# Altium schematic sheet ESP32.SchDoc
size B
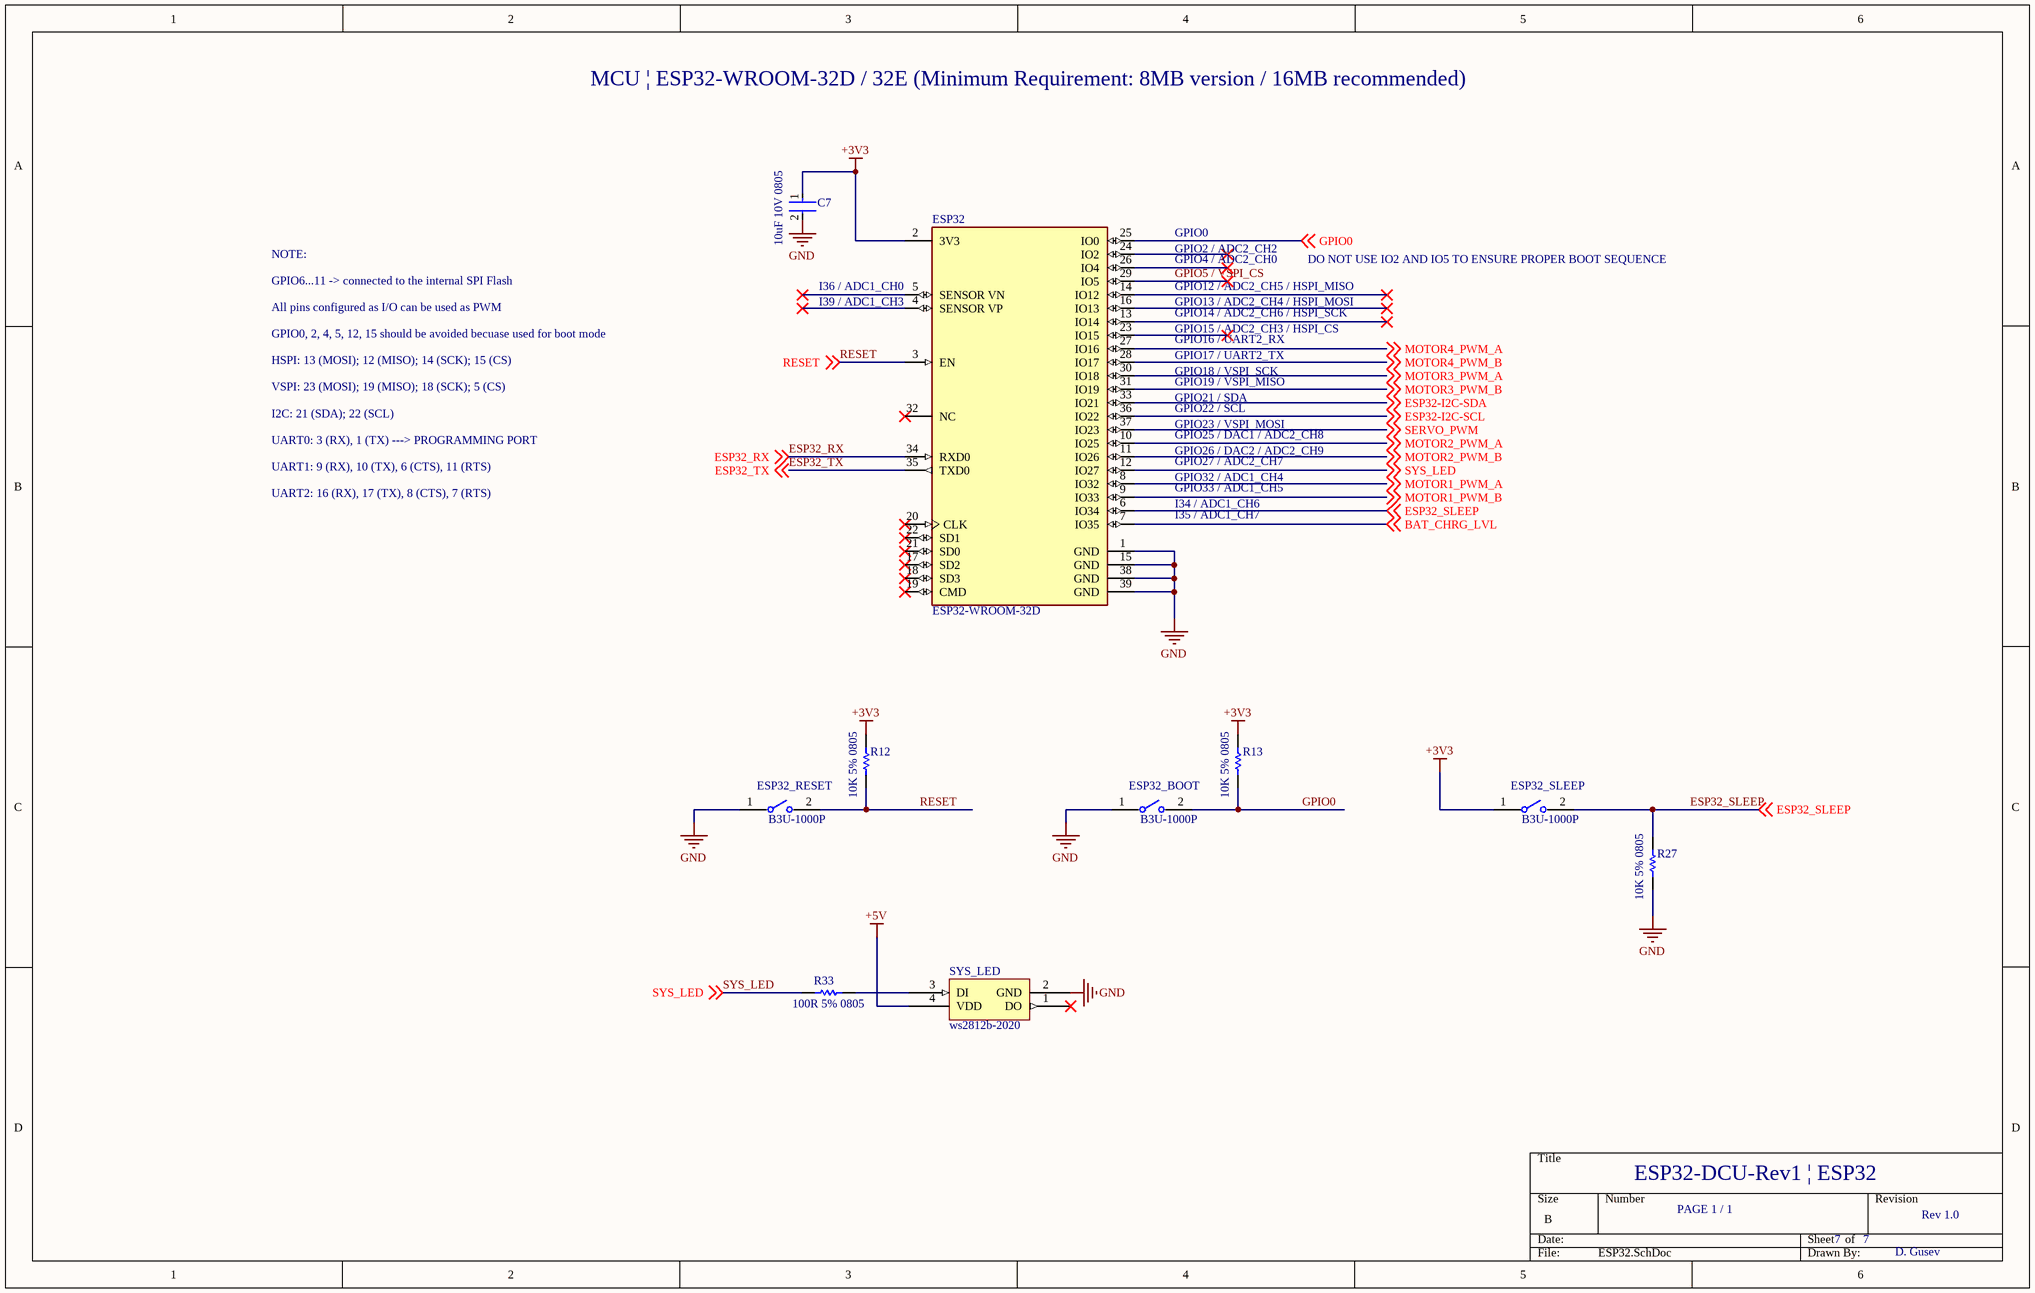
[diagram p0: ESP32.SchDoc]

## Parts
C7  10uF 10V 0805  [FP-C0805C-DG-MFG]
ESP32  ESP32-WROOM-32D  [ESP32-WROOM-U]
ESP32_BOOT  B3U-1000P  [FP-B3U-1000P-MFG]
ESP32_RESET  B3U-1000P  [FP-B3U-1000P-MFG]
ESP32_SLEEP  B3U-1000P  [FP-B3U-1000P-MFG]
R12  10K 5% 0805  [RESC2013X60X40ML20T25]
R13  10K 5% 0805  [RESC2013X60X40ML20T25]
R27  10K 5% 0805  [RESC2013X60X40ML20T25]
R33  100R 5% 0805  [RESC2013X60X35ML10T20]
SYS_LED  ws2812b-2020  [ws2812b]

## Nets
+3V3: C7.1 ESP32.2(3V3) ESP32_SLEEP.1 R12.2 R13.2
+5V: SYS_LED.4(VDD)
GND: C7.2 ESP32.1(GND) ESP32.15(GND) ESP32.38(GND) ESP32.39(GND) ESP32_BOOT.1 ESP32_RESET.1 R27.1 SYS_LED.2(GND)
BAT_CHRG_LVL: ESP32.7(IO35) ; off-sheet BAT_CHRG_LVL
ESP32-I2C-SCL: ESP32.36(IO22) ; off-sheet ESP32-I2C-SCL
ESP32-I2C-SDA: ESP32.33(IO21) ; off-sheet ESP32-I2C-SDA
ESP32_RX: ESP32.34(RXD0) ; off-sheet ESP32_RX
ESP32_SLEEP: ESP32.6(IO34) ESP32_SLEEP.2 R27.2 ; off-sheet ESP32_SLEEP
ESP32_TX: ESP32.35(TXD0) ; off-sheet ESP32_TX
GPIO0: ESP32.25(IO0) ESP32_BOOT.2 R13.1 ; off-sheet GPIO0
GPIO5 / VSPI_CS: ESP32.29(IO5)
MOTOR1_PWM_A: ESP32.8(IO32) ; off-sheet MOTOR1_PWM_A
MOTOR1_PWM_B: ESP32.9(IO33) ; off-sheet MOTOR1_PWM_B
MOTOR2_PWM_A: ESP32.10(IO25) ; off-sheet MOTOR2_PWM_A
MOTOR2_PWM_B: ESP32.11(IO26) ; off-sheet MOTOR2_PWM_B
MOTOR3_PWM_A: ESP32.30(IO18) ; off-sheet MOTOR3_PWM_A
MOTOR3_PWM_B: ESP32.31(IO19) ; off-sheet MOTOR3_PWM_B
MOTOR4_PWM_A: ESP32.27(IO16) ; off-sheet MOTOR4_PWM_A
MOTOR4_PWM_B: ESP32.28(IO17) ; off-sheet MOTOR4_PWM_B
RESET: ESP32.3(EN) ESP32_RESET.2 R12.1 ; off-sheet RESET
SERVO_PWM: ESP32.37(IO23) ; off-sheet SERVO_PWM
SYS_LED: ESP32.12(IO27) R33.1 ; off-sheet SYS_LED
NetR33_2: R33.2 SYS_LED.3(DI)

Not connected (* = marked no-connect by the designer): ESP32 4(SENSOR_VP)* 5(SENSOR_VN)* 13(IO14)* 14(IO12)* 16(IO13)* 17(SD2)* 18(SD3)* 19(CMD)* 20(CLK)* 21(SD0)* 22(SD1)* 23(IO15)* 24(IO2)* 26(IO4)* 32(NC)*; SYS_LED 1(DO)*

## Notes on the sheet
- MCU | ESP32-WROOM-32D / 32E (Minimum Requirement: 8MB version / 16MB recommended)
- GPIO0
- NOTE:
- GPIO6...11 -> connected to the internal SPI Flash
- (near ESP32) I36 / ADC1_CH0
- GPIO2 / ADC2_CH2
- GPIO4 / ADC2_CH0
- GPIO12 / ADC2_CH5 / HSPI_MISO
- DO NOT USE IO2 AND IO5 TO ENSURE PROPER BOOT SEQUENCE
- All pins configured as I/O can be used as PWM
- GPIO0, 2, 4, 5, 12, 15 should be avoided becuase used for boot mode
- HSPI: 13 (MOSI); 12 (MISO); 14 (SCK); 15 (CS)
- (near ESP32) I39 / ADC1_CH3
- GPIO13 / ADC2_CH4 / HSPI_MOSI
- GPIO14 / ADC2_CH6 / HSPI_SCK
- GPIO15 / ADC2_CH3 / HSPI_CS
- GPIO16 / UART2_RX
- GPIO17 / UART2_TX
- VSPI: 23 (MOSI); 19 (MISO); 18 (SCK); 5 (CS)
- I2C: 21 (SDA); 22 (SCL)
- GPIO18 / VSPI_SCK
- GPIO19 / VSPI_MISO
- GPIO21 / SDA
- GPIO22 / SCL
- GPIO23 / VSPI_MOSI
- GPIO25 / DAC1 / ADC2_CH8
- UART0: 3 (RX), 1 (TX) ---> PROGRAMMING PORT
- UART1: 9 (RX), 10 (TX), 6 (CTS), 11 (RTS)
- UART2: 16 (RX), 17 (TX), 8 (CTS), 7 (RTS)
- GPIO26 / DAC2 / ADC2_CH9
- GPIO27 / ADC2_CH7
- GPIO32 / ADC1_CH4
- GPIO33 / ADC1_CH5
- I34 / ADC1_CH6
- I35 / ADC1_CH7
- ESP32-DCU-Rev1 | ESP32
- PAGE 1 / 1
- 7
- Rev 1.0
- D. Gusev

## Library data of the parts
C7 = CMP-2007-03243-2: CAP CER 10UF 10V X5R 0805; Manufacturer Part Number: C0805C106K8PACTU; Manufacturer: Kemet; 3DS Part Number: 220-00001; Tolerance: 10%; Temperature Coefficient: 15%; Material: Ceramic; Device Class L2: Capacitors; Device Class L1: Passive Components; ComponentLink2URL: https://content.kemet.com/datasheets/KEM_C1006_X5R_SMD.pdf; Height: 1.4mm; Lead Free: Yes; Digikey Description: CAP CER 10UF 10V X5R 0805; Octopart: https://octopart.com/c0805c106k8pactu-kemet-98697; Capacitance: 10uF; Value: 10uF; Temperature Range Low: -55°C; Temperature: -55°C to +85°C; Automotive: No; Mouser Description: CAP CER 10UF 10V X5R 0805; Ipc Land Pattern Name: CAPC200125X125; Temperature Range High: +85°C; Voltage: 10V; RoHS: TRUE; Device Class L3: Ceramic Capacitors; ComponentLink2Description: Datasheet; Voltage Rating: 10V; Package: C0805C-DG; Temperature Characteristic: X5R; Category: Cap
ESP32 = ESP32-WROOM-U: WIFI MODULE 32MBITS SPI FLASH; Manufacturer: Espressif Systems; Max Supply Voltage: 3.6V; Nominal Supply Current: 500mA; Max Frequency: 2484MHz; Number Of Adc Channels: 16; Number Of Gpio: 32; Interface: I2C,SPI,UART,Ethernet,I2S,Other; Data Rate: 150Mbits/s; Min Supply Voltage: 3V; Bandwidth: 72MHz; Sensitivity: -98dBm; Octopart: https://octopart.com/esp32-wroom-32d-espressif+systems-91040050; Package: ESP32-WROOM-32D; ComponentLink2URL: https://www.espressif.com/sites/default/files/documentation/esp32-wroom-32d_esp32-wroom-32u_datasheet_en.pdf; Lead Free: Yes; Category: UNK; Mouser Description: Wi-Fi/BT BLE Module ESP32-D0WD, SPI Flash, UART, P; Device Class L1: Integrated Circuits (ICs); RoHS: TRUE; Temperature Range Low: -40°C; ComponentLink2Description: Datasheet; Digikey Description: WIFI MODULE 32MBITS SPI FLASH; Height: 3.2mm; Temperature: -40°C to +85°C; Manufacturer Part Number: ESP32-WROOM-32D; Device Class L3: Transceivers; Device Class L2: RF Semiconductors and Devices; Temperature Range High: +85°C; Automotive: No
ESP32_BOOT ESP32_RESET ESP32_SLEEP = CMP-2100-03586-2: SWITCH TACTILE SPST-NO 0.05A 12V; Contact Resistance: 100mR; Operating Force: 1.5N; Max Current Rating: 50mA; Switch Travel: 0.15mm; Actuator Type: Standard; Mechanical Life: 200000Cycles; Ratings: Dust Proof; Illumination Type: Non-Illuminated; Throw Configuration: SPST; Actuator Length: 0.4mm; Switch Function: Off-Mom; Height: 1.2mm; Width: 3mm; Weight: 0.000776oz; Contact Material: Silver; Max Voltage Rating (DC): 12V; Insulation Resistance: 100MR; Lead Free: Lead Free; Current Rating: 50mA; Termination: SMD/SMT; Length: 4mm; Voltage Rating (DC): 12V; Contact Current Rating: 50mA; Orientation: Straight; Depth: 2.5mm; Max Operating Temperature: 70°C; Packaging: Tape and Reel; Min Operating Temperature: -25°C; Package Quantity: 1; Mount: Surface Mount; Electrical Life: 200000Cycles
R12 R13 R27 = CMP-2001-00590-1: Part Number: ERA6AEB123V; Manufacturer: Panasonic
R33 = CMP-2100-03669-1: Chip Resistor, 100 Ohm, +/-1%, 0.125 W, -55 to 155 degC, 0805 (2012 Metric), RoHS, Tape and Reel; Manufacturer: Yageo; Power Rating: 125mW; Resistance: 100Ohm; Voltage Rating: 150V; Tolerance: 1%; Temperature Coefficient: 100ppm/degreesC; Length: 2mm; Package Description: 2-Pin Surface Mounted Device, Body 2 x 1.25 mm; Case Code (Imperial): 0805; Number of Pins: 2; Termination: SMD/SMT; Lead Pitch: 0.4mm; Package Quantity: 1; Height: 0.024inch; Case Code (Metric): 2012; Number of Terminations: 2; Datasheet Version: Rev. 5, 10/2016; Lead Free: LeadFree; Package Reference: 0805; Composition: ThickFilm; REACH SVHC: Unknown; Voltage Rating (DC): 150V; Min Operating Temperature: -55degC; Packaging: TapeandReel; Military Standard: Not; Case/Package: 0805; Datasheet URL: http://www.yageo.com/NewPortal/yageodocoutput?fileName=/pdf/R-Chip/PYu-RC_Group_51_RoHS_L_5.pdf; Max Operating Temperature: 155degC; Manufacturer URL: http://www.yageo.com/; Max Power Dissipation: 125mW; Width: 0.049inch; Depth: 1.25mm; RoHSCompliant: true